# Altium schematic sheet Schematic1.SchDoc
size B; SheetNumber: 1; SheetTotal: 1
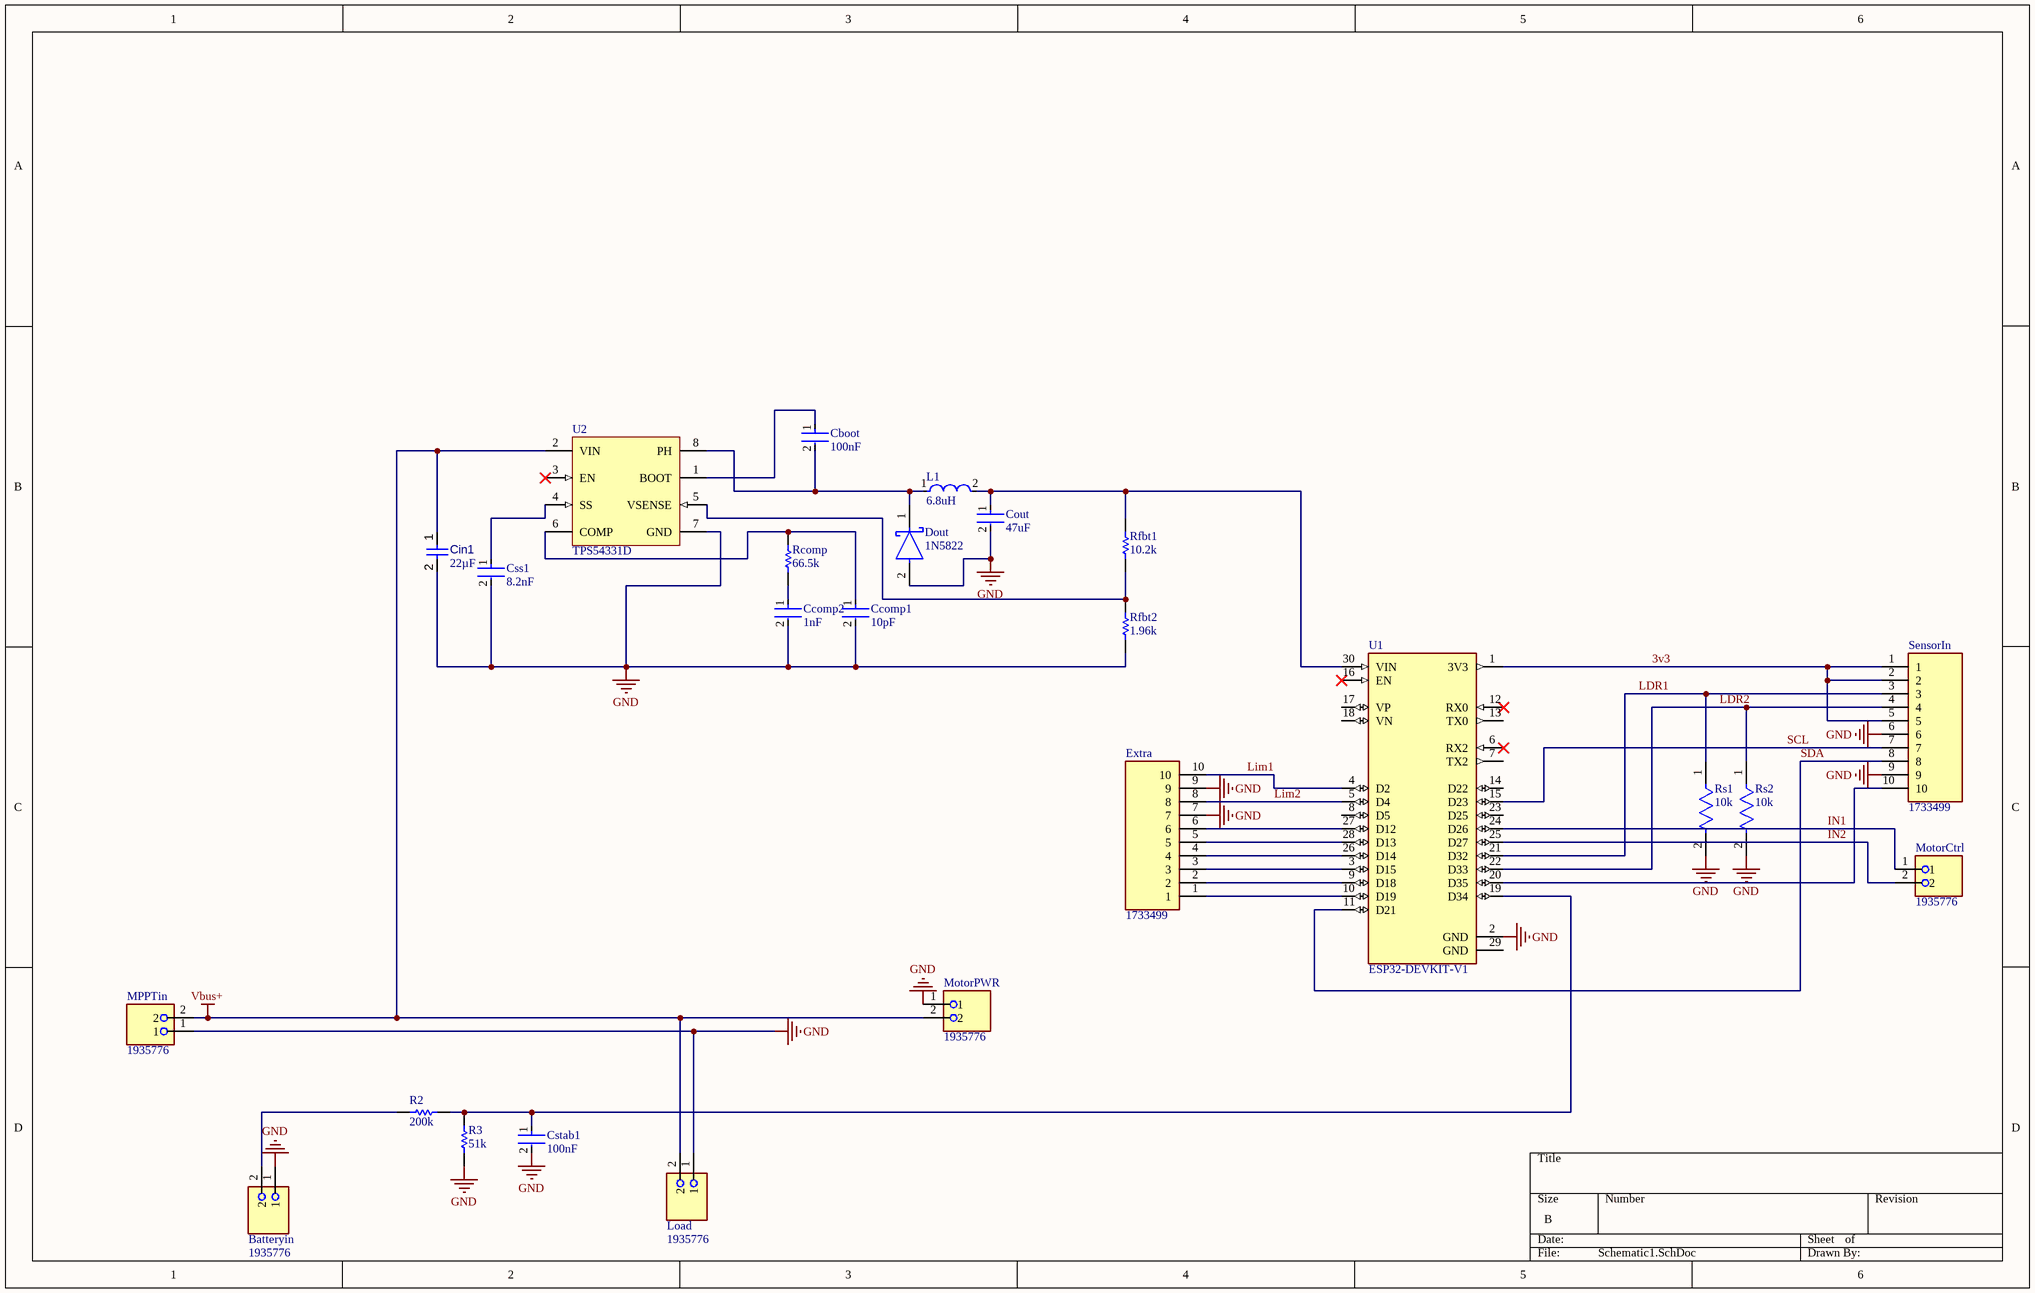
[diagram p0: Schematic1.SchDoc]

## Parts
Batteryin  1935776  [PHOENIX_1935776]
Cboot  100nF  [FP-CC0805-0_85-MFG]
Ccomp1  10pF  [FP-C0805C-DN-MFG]
Ccomp2  1nF  [FP-CC0805-0_85-MFG]
Cin1  value 22µF  [CAPC0805(2012)145_L]  (hidden comment: Capacitor 22µF +/-40% 16V 0805)
Cout  47uF  [FP-GRM21B-0_2-e0_2_0_7-IPC_A]
Css1  8.2nF  [FP-GRM219-0_1-IPC_C]
Cstab1  100nF  [FP-CC0805-0_85-MFG]
Dout  1N5822  [FP-DO-201AD-MFG]
Extra  1733499  [1733499]
L1  6.8uH  [FP-MLZ2012-0_85-IPC_A]
Load  1935776  [PHOENIX_1935776]
MotorCtrl  1935776  [PHOENIX_1935776]
MotorPWR  1935776  [PHOENIX_1935776]
MPPTin  1935776  [PHOENIX_1935776]
R2  200k  [RESC2013X50X30NL20T20]
R3  51k  [RESC2013X50X30NL20T20]
Rcomp  66.5k  [RESC2013X50X30LL20T20]
Rfbt1  10.2k  [RESC2013X50X30NL20T20]
Rfbt2  1.96k  [RESC2013X50X30LL20T20]
Rs1  10k  [FP-CRCW0805-e3-IPC_A]
Rs2  10k  [FP-CRCW0805-e3-IPC_A]
SensorIn  1733499  [1733499]
U1  ESP32-DEVKIT-V1  [MODULE_ESP32_DEVKIT_V1]
U2  TPS54331D  [D0008A_L]

## Nets
GND: Batteryin.1 Ccomp1.2 Ccomp2.2 Cin1.2 Cout.2 Css1.2 Cstab1.2 Dout.2(A) Extra.7 Extra.9 Load.1 MotorPWR.1 MPPTin.1 R3.1 Rfbt2.1 Rs1.2 Rs2.2 SensorIn.6 SensorIn.9 U1.2(GND) U2.7(GND)
Vbus+: Cin1.1 Load.2 MotorPWR.2 MPPTin.2 U2.2(VIN)
3v3: SensorIn.1 SensorIn.2 SensorIn.5 U1.1(3V3)
IN1: MotorCtrl.1 U1.24(D26)
IN2: MotorCtrl.2 U1.25(D27)
LDR1: Rs1.1 SensorIn.3 U1.21(D32)
LDR2: Rs2.1 SensorIn.4 U1.22(D33)
Lim1: Extra.10 U1.4(D2)
Lim2: Extra.8 U1.5(D4)
SCL: SensorIn.7 U1.15(D23)
SDA: SensorIn.8 U1.11(D21)
NetBatteryin_2: Batteryin.2 R2.1
NetCboot_1: Cboot.1 U2.1(BOOT)
NetCboot_2: Cboot.2 Dout.1(C) L1.1 U2.8(PH)
NetCcomp1_1: Ccomp1.1 Rcomp.2 U2.6(COMP)
NetCcomp2_1: Ccomp2.1 Rcomp.1
NetCout_1: Cout.1 L1.2 Rfbt1.2 U1.30(VIN)
NetCss1_1: Css1.1 U2.4(SS)
NetCstab1_1: Cstab1.1 R2.2 R3.2 U1.19(D34)
NetExtra_1: Extra.1 U1.10(D19)
NetExtra_2: Extra.2 U1.9(D18)
NetExtra_3: Extra.3 U1.3(D15)
NetExtra_4: Extra.4 U1.26(D14)
NetExtra_5: Extra.5 U1.28(D13)
NetExtra_6: Extra.6 U1.27(D12)
NetRfbt1_1: Rfbt1.1 Rfbt2.2 U2.5(VSENSE)
NetSensorIn_10: SensorIn.10 U1.20(D35)

Not connected (* = marked no-connect by the designer): U1 6(RX2)* 7(TX2) 8(D5) 12(RX0)* 13(TX0) 14(D22) 16(EN)* 17(VP) 18(VN) 23(D25) 29(GND); U2 3(EN)*

## Library data of the parts
Batteryin Load MotorCtrl MotorPWR MPPTin = 1935776: MF: {'manufacturer': u'Phoenix Contact'}; Package: None; Price: None; Value: *; MP: 1935776; Availability: Unavailable
Cboot Cstab1 = CMP-2100-03606-3: CAP CER 0.1UF 50V X7R 0805; Manufacturer Part Number: CC0805KRX7R9BB104; Manufacturer: Yageo; Tolerance: 0.1; Device Class L1: Passive Components; ComponentLink2Description: Datasheet; Package: CC0805-0.85; Digikey Description: CAP CER 0.1UF 50V X7R 0805; Capacitance: 100 nF; Device Class L3: Ceramic Capacitors; Value: 100 nF; Temperature: -30°C to +85°C; Temperature Characteristic: X7R; Voltage Rating: 50 V; Height: 0.95mm; RoHS: TRUE; Ipc Land Pattern Name: CAPC200125X85; Device Class L2: Capacitors; Category: Cap; Temperature Range Low: -30°C; Temperature Range High: +85°C; Material: Ceramic; Mouser Description: Multilayer Ceramic Capacitors MLCC - SMD/SMT 100nF 50V X7R 10%; Footprint Url: http://www.yageo.com/exep/pages/download/literatures/UPY-C_GEN_24.pdf; Automotive: No; Octopart: https://octopart.com/cc0805krx7r9bb104-yageo-192993; Lead Free: Yes; ComponentLink2URL: http://www.yageo.com/documents/recent/UPY-GPHC_Y5V_6.3V-to-50V_8.pdf
Ccomp1 = CMP-2007-00219-2: Capacitor; Ceramic; Cap 10 pF; Tol 5%; Vol-Rtg 50 VDC; SMT; 0805; COG (NPO); Tape&Reel; Manufacturer Part Number: C0805C100J5GACTU; Manufacturer: KEMET; Temperature Coefficient: 30ppm/°C; Voltage Rating: 50 V; Tolerance: 0.05; Temperature Characteristic: C0G; RoHS: TRUE; Mouser Description: KEMET - C0805C100J5GACTU - CAP, MLCC, C0G/NP0, 10PF, 50V, 0805; Temperature Range High: +125°C; Octopart: https://octopart.com/c0805c100j5gactu-kemet-104357; Automotive: No; Device Class L1: Passive Components; Temperature Range Low: -55°C; Value: 10 pF; Device Class L3: Ceramic Capacitors; Material: Ceramic; Device Class L2: Capacitors; Lead Free: Yes; Category: Cap; Ipc Land Pattern Name: CAPC200125X78; ComponentLink2Description: Datasheet; ComponentLink2URL: https://content.kemet.com/datasheets/KEM_C1003_C0G_SMD.pdf; Digikey Description: Capacitor; Ceramic; Cap 10 pF; Tol 5%; Vol-Rtg 50 VDC; SMT; 0805; COG (NPO); Tape&Reel; Temperature: -55°C to +125°C; Height: 0.88mm; Capacitance: 10 pF; Package: C0805C-DN
Ccomp2 = CMP-2100-03606-3: CAP CER 0.1UF 50V X7R 0805; Manufacturer Part Number: CC0805KRX7R9BB104; Manufacturer: Yageo; Tolerance: 0.1; Capacitance: 100 nF; Value: 100 nF; Device Class L1: Passive Components; ComponentLink2Description: Datasheet; Package: CC0805-0.85; Digikey Description: CAP CER 0.1UF 50V X7R 0805; Device Class L3: Ceramic Capacitors; Temperature: -30°C to +85°C; Temperature Characteristic: X7R; Voltage Rating: 50 V; Height: 0.95mm; RoHS: TRUE; Ipc Land Pattern Name: CAPC200125X85; Device Class L2: Capacitors; Category: Cap; Temperature Range Low: -30°C; Temperature Range High: +85°C; Material: Ceramic; Mouser Description: Multilayer Ceramic Capacitors MLCC - SMD/SMT 100nF 50V X7R 10%; Footprint Url: http://www.yageo.com/exep/pages/download/literatures/UPY-C_GEN_24.pdf; Automotive: No; Octopart: https://octopart.com/cc0805krx7r9bb104-yageo-192993; Lead Free: Yes; ComponentLink2URL: http://www.yageo.com/documents/recent/UPY-GPHC_Y5V_6.3V-to-50V_8.pdf
Cin1 = CMP-001-00081-4: Chip Capacitor, 22µF +/-40%, 16V, 0805, Thickness 1.45 mm; Tolerance: 5%; Voltage Rating: 16V; Mounting Technology: SMT; Pins: 2; Max Operating Temperature: 85°C; Case/Package: 0805; Min Operating Temperature: -55°C
Cout = CMP-2000-06341-2: Chip Multilayer Ceramic Capacitors for General Purpose, 0805, 47uF, X5R, 15%, 20%, 10V; Dissipation Factor: 0.035%; Length: 2mm; Voltage Rating: 10V; Mount: Surface Mount; Width: 0.049inch; Voltage Rating (DC): 10V; Lead Free: Lead Free; REACH SVHC: No SVHC; Termination: SMD/SMT; Case/Package: 0805; Dielectric: X5R; Capacitance: 47uF; Packaging: Tape and Reel; Max Operating Temperature: 85°C; Tolerance: 20%; Thickness: 0.057inch; Dielectric Material: Ceramic; Min Operating Temperature: -55°C; Height: 1.25mm; Case Code (Imperial): 0805; Case Code (Metric): 2012; Depth: 1.25mm; Voltage: 10V
Css1 = CMP-1036-03771-2: Chip Multilayer Ceramic Capacitors for General Purpose, 0805, 8200pF, C0G, 30ppm/°C, 5%, 50V; Tolerance: 5%; Temperature Coefficient: 30ppm/°C; Min Operating Temperature: -55°C; Max Operating Temperature: 125°C; Depth: 1.25mm; Package Quantity: 1; Mount: Surface Mount; Dielectric: C0G; Lead Free: Lead Free; Capacitance: 8.2nF; Thickness: 0.037inch; Case Code (Metric): 2012; Voltage: 50V; REACH SVHC: No SVHC; Case/Package: 0805; Width: 0.049inch; Voltage Rating: 50V; Voltage Rating (DC): 50V; Height: 0.85mm; Packaging: Tape and Reel; Radiation Hardening: No; Length: 2mm; Termination: SMD/SMT; Case Code (Imperial): 0805
Dout = CMP-12187-000025-1: DIODE SCHOTTKY 40V 3A DO201AD; Manufacturer: STMicroelectronics; Max Junction Temp: +150°C; Peak Reverse Current: 2mA; Max Surge Forward Current: 80A; Temperature Range High: +150°C; Automotive: No; RoHS: TRUE; ComponentLink2Description: Datasheet; Manufacturer Part Number: 1N5822; Lead Free: Yes; Octopart: https://octopart.com/1n5822-stmicroelectronics-323225; Device Class L2: Diodes; Max Repetitive Reverse Voltage: 40V; Temperature: to +150°C; Height: 5.3mm; Category: Diode; Digikey Description: DIODE SCHOTTKY 40V 3A DO201AD; ComponentLink2URL: https://www.st.com/resource/en/datasheet/1n5822.pdf; Device Class L3: Schottky Diodes; Device Class L1: Discrete Semiconductors; Forward Current: 3A; Mouser Description: Schottky Diodes & Rectifiers Vr/40V Io/3A BULK; Package: DO-201AD
Extra SensorIn = 1733499: Connector; Manufacturer_Name: Phoenix Contact; Datasheet Link: http://www.phoenixcontact.com/de/produkte/1733499/pdf; Height: 15.45mm; Manufacturer_Part_Number: 1733499; Mouser Part Number: 651-1733499; Mouser Price/Stock: https://www.mouser.co.uk/ProductDetail/Phoenix-Contact/1733499?qs=UV0HhPl4yOFiQR6YsGGjJA%3D%3D; Arrow Part Number: 1733499; Arrow Price/Stock: https://www.arrow.com/en/products/1733499/phoenix-contact?utm_currency=USD&region=nac
L1 = CMP-08253-000092-1: Shielded Multilayer Inductor 6.8uH ±20% 550mA 325mΩ SMD 0805; Test Frequency: 2MHz; Self Resonant Frequency: 60MHz; Saturation Current: 110mA; Core Material: Ferrite; DC Resistance (DCR): 250mR; Current Rating: 550mA; Case/Package: 0805; Height - Seated (Max): 0.057inch; Lead Free: Lead Free; Mount: Surface Mount; Max Operating Temperature: 125°C; Length: 0.079inch; Min Operating Temperature: -55°C; RoHS Compliant: Yes; Case Code (Imperial): 0805; Shielding: Shielded; Tolerance: 20%; Width: 0.049inch; Inductance: 6.8uH; Packaging: Tape and Reel; Package Quantity: 1; Case Code (Metric): 2012
R2 = CMP-2001-03662-1: Part Number: CRCW0805200KJNEA; Manufacturer: Vishay Dale
R3 = CMP-2001-03993-1: Manufacturer: Vishay Dale; Part Number: CRCW080551K0FKEA
Rcomp = CMP-2001-04062-1: Part Number: CRCW080566K5FKEA; Manufacturer: Vishay Dale
Rfbt1 = CMP-1013-00624-2: Manufacturer: Vishay Dale; Part Number: CRCW080510K2FKEA
Rfbt2 = CMP-2001-03629-1: Part Number: CRCW08051K96FKEA; Manufacturer: Vishay Dale
Rs1 Rs2 = CMP-2001-04908-2: RES Thick Film, 10kΩ, 1%, 0.125W, 100ppm/°C, 0805; Resistance: 10kR; Voltage Rating (DC): 150V; Power Rating: 125mW; Weight: 0.000194oz; Package Quantity: 5000; Military Standard: Not; Max Operating Temperature: 155°C; Temperature Coefficient: 100ppm/°C; Contact Plating: Tin; Width: 1.25mm; Height: 0.45mm; Radiation Hardening: No; Tolerance: 1%; Min Operating Temperature: -55°C; Voltage Rating: 150V; Length: 2mm; Depth: 1.25mm; Termination: SMD/SMT; Packaging: Tape and Reel; Case/Package: 0805; Case Code (Metric): 2012; Lead Free: Lead Free; Case Code (Imperial): 0805; Composition: Thick Film
U1 = CMP-003-000000-1: Dual core, Wi-Fi: 2.4 GHz up to 150 Mbits/s,BLE (Bluetooth Low Energy) and legacy Bluetooth, 32 bits, Up to 240 MHz; MF: Do it; Package: None; SnapEDA_Link: https://www.snapeda.com/parts/ESP32-DEVKIT-V1/Do+it/view-part/?ref=snap; Design Item ID: ESP32-DEVKIT-V1; Pin Count: 30; Source: ESP32-DEVKIT-V1.SchLib; Check_prices: https://www.snapeda.com/parts/ESP32-DEVKIT-V1/Do+it/view-part/?ref=eda; Component Type: Standard; Value: *; MP: ESP32-DEVKIT-V1
U2 = CMP-0323-00203-3: Buck Step Down Regulator with 3.5 to 28 V Input and 0.8 to 25 V Output, -40 to 150 degC, 8-Pin SOIC (D), Green (RoHS & no Sb/Br); Manufacturer: Texas Instruments; Regulated Outputs(#): 1; Vout(Min)(V): 0.8; Iout(Max)(A): 3; Vin(Min)(V): 3.5; Rating: Catalog; SubFamily: Step-Down Regulator; Vout(Max)(V): 25; Iq(Typ)(mA): 0.11; Vin(Max)(V): 28; Duty Cycle(Max)(%): 90; ComponentLink3Description: URL Link1; ComponentLink1URL: http://www.ti.com/general/docs/lit/getliterature.tsp?genericPartNumber=TPS54331&fileType=pdf; Code_JEDEC: MS-012AA; PartNumber: TPS54331D; PackageVersion: revM, Jun-2011; ComponentLink1Description: Datasheet; PackageReference: D0008A; Eco-Plan: Green (RoHS & no Sb/Br); PackageDescription: 8-Pin Plastic Small Outline Integrated Circuit, 4.9 x 3.9 mm, Pitch 1.27 mm Pitch; ComponentLink2URL: http://www.ti.com/litv/pdf/msoi002j; DatasheetVersion: SLVS839D; Topology: Buck; Switch Current Limit(Typ)(A): 3.5; ComponentLink3URL: Samples URL:http://www.ti.com/product/tps54331#samples; ComponentLink2Description: Package Specification; Mounting Technology: Surface Mount